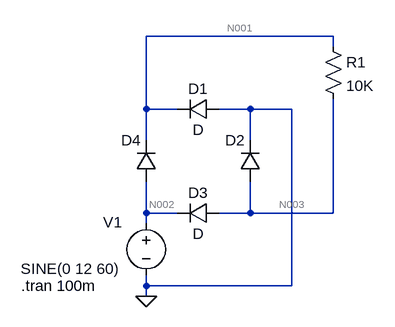
[diagram p0: schematic full_wave_graetz.asc]
full_wave_graetz.asc, the LTspice schematic file:
Version 4.1
SHEET 1 880 680
WIRE 368 -32 80 -32
WIRE 368 -16 368 -32
WIRE 80 80 80 -32
WIRE 128 80 80 80
WIRE 240 80 192 80
WIRE 304 80 240 80
WIRE 80 128 80 80
WIRE 240 128 240 80
WIRE 80 240 80 192
WIRE 128 240 80 240
WIRE 240 240 240 192
WIRE 240 240 192 240
WIRE 368 240 368 64
WIRE 368 240 240 240
WIRE 80 256 80 240
WIRE 80 352 80 336
WIRE 304 352 304 80
WIRE 304 352 80 352
WIRE 80 368 80 352
FLAG 80 368 0
SYMBOL diode 192 64 R90
WINDOW 0 0 32 VBottom 2
WINDOW 3 32 32 VTop 2
SYMATTR InstName D1
SYMBOL diode 256 192 R180
WINDOW 0 24 64 Left 2
WINDOW 3 24 0 Invisible 2
SYMATTR InstName D2
SYMBOL diode 192 224 R90
WINDOW 0 0 32 VBottom 2
WINDOW 3 32 32 VTop 2
SYMATTR InstName D3
SYMBOL diode 96 192 R180
WINDOW 0 24 64 Left 2
WINDOW 3 24 0 Invisible 2
SYMATTR InstName D4
SYMBOL res 352 -32 R0
SYMATTR InstName R1
SYMATTR Value 10K
SYMBOL voltage 80 240 R0
WINDOW 0 -66 14 Left 2
WINDOW 3 -193 86 Left 2
WINDOW 123 0 0 Left 0
WINDOW 39 0 0 Left 0
SYMATTR InstName V1
SYMATTR Value SINE(0 12 60)
TEXT -112 352 Left 2 !.tran 100m

The netlist it stands for:
* full_wave_graetz.asc
D1 0 N001 D
D2 N003 0 D
D3 N003 N002 D
D4 N002 N001 D
R1 N001 N003 10K
V1 N002 0 SINE(0 12 60)
.model D D
.lib standard.dio
.tran 100m
.backanno
.end

* Results of the author's LTspice run, read from the files saved beside the schematic
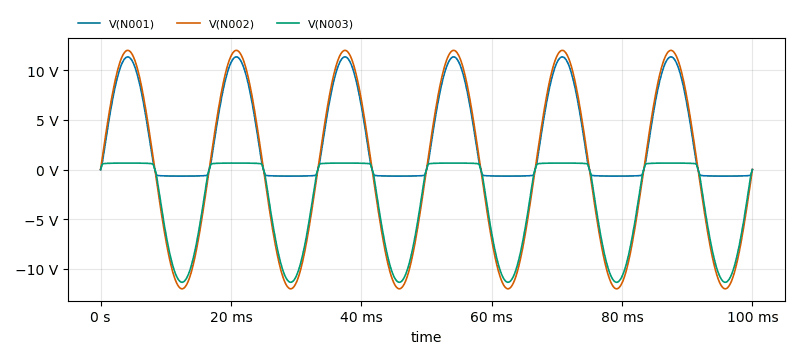
[diagram p1: Transient Analysis of full_wave_graetz.asc, plotted from the saved traces]
* Transient Analysis, 1 run:
*   V(N001): min -656.8 mV, max 11.34 V, average 3.202 V, rms 5.608 V, last 0 V
*   V(N002): min -12 V, max 12 V, average 0 V, rms 8.485 V, last 0 V
*   V(N003): min -11.34 V, max 656.8 mV, average -3.202 V, rms 5.608 V, last 0 V